# EAGLE design chipheater_01 (EAGLE 9.6.0)
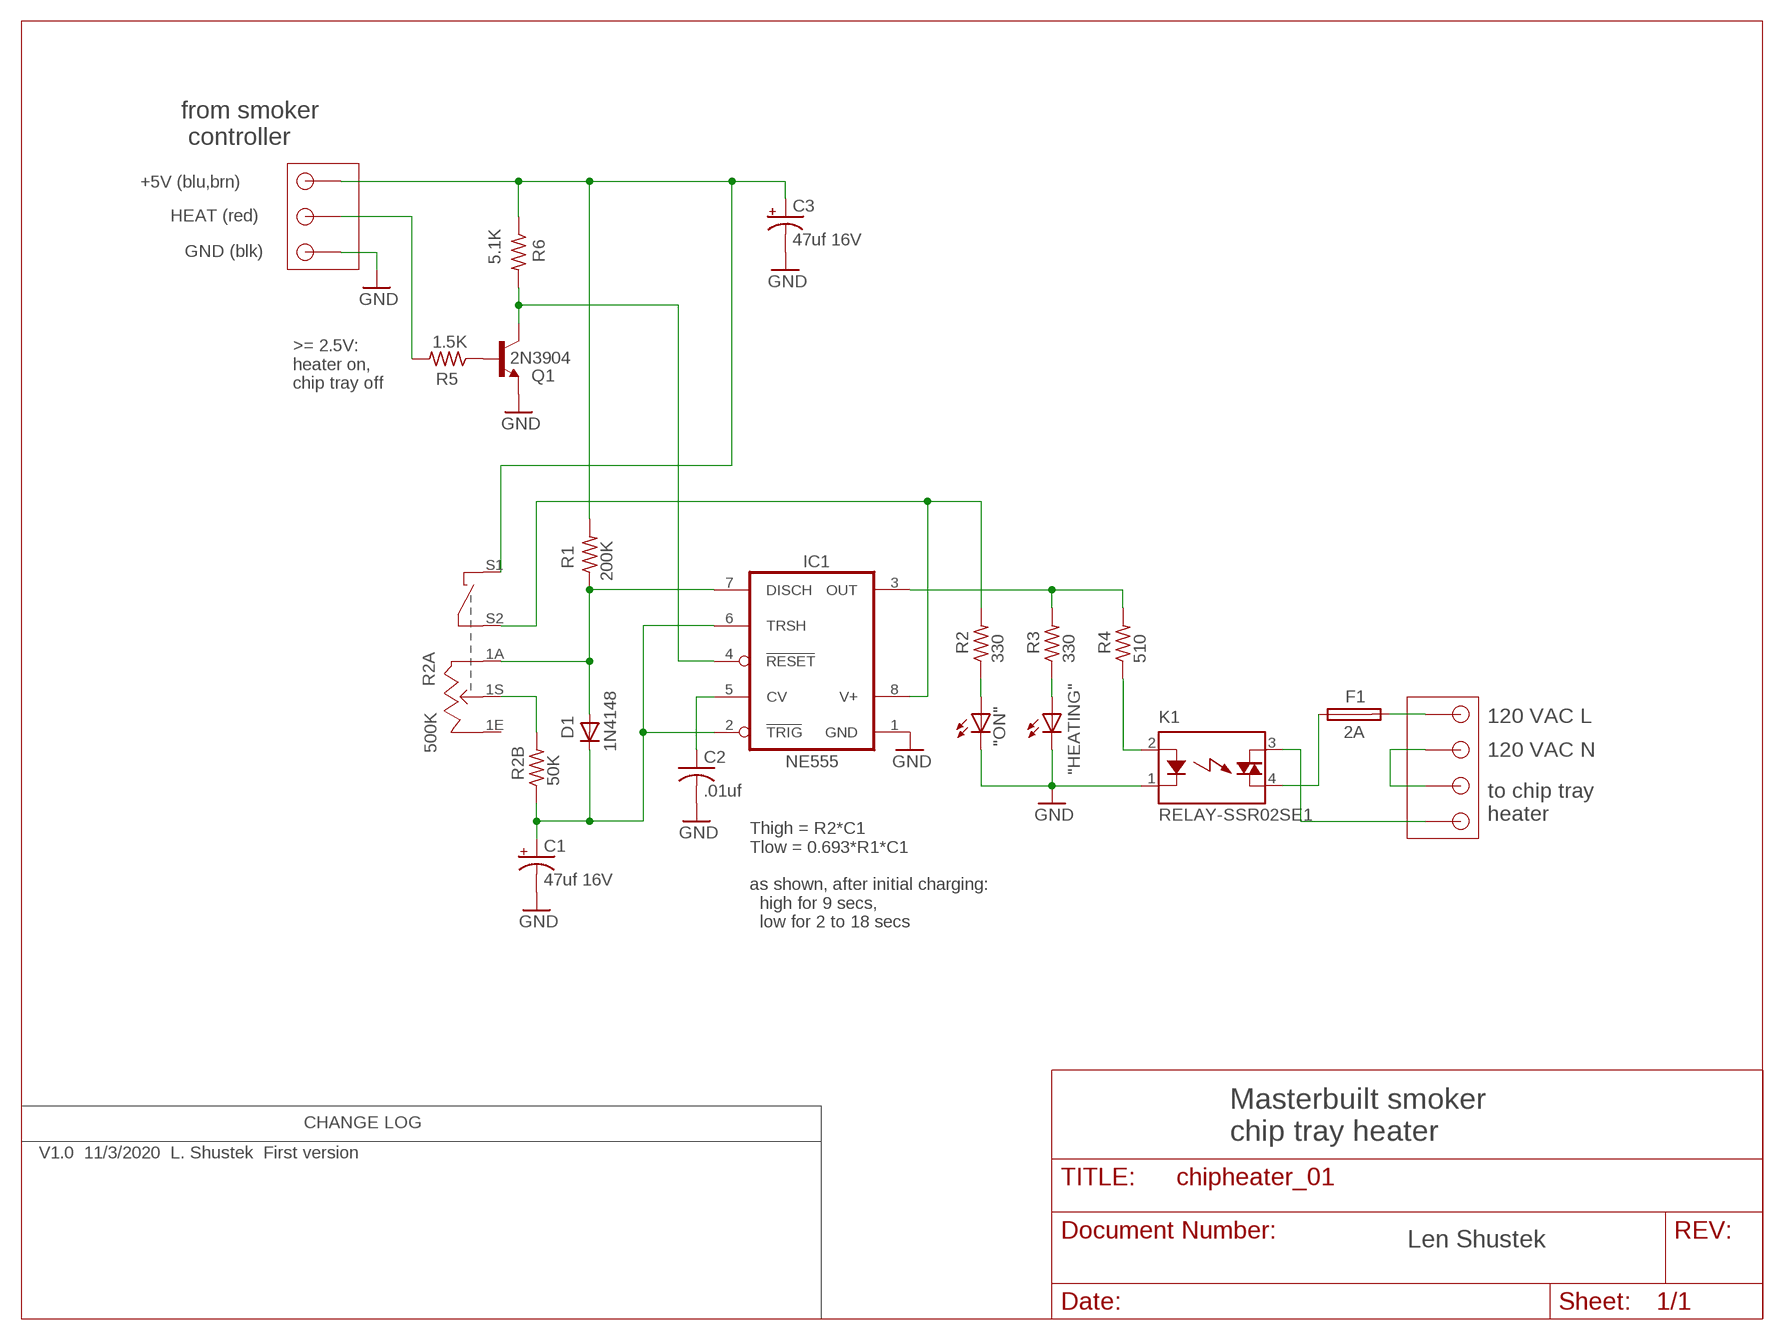
[diagram p0: schematic, sheet 1]

## Parts
"HEATING"  LED5MM  [LED5MM]
"ON"  LED5MM  [LED5MM]
C1  47uf 16V  CPOL-USE2.5-5  [E2,5-5]
C2  .01uf  C-US025-025X050  [C025-025X050]
C3  47uf 16V  CPOL-USE2.5-5  [E2,5-5]
D1  1N4148  DIODEDO-1N4148  [DO-1N4148]
F1  2A  FUSESH22,5A  [SH22,5A]
IC1  NE555  ICM7555  [DIL08]
K1  RELAY-SSR02SE1  [RELAY-SSR]
Q1  2N3904  [TO92]
R1  200K  R-US_0204/7  [0204/7]
R2  330  R-US_0204/7  [0204/7]
R2A  500K  POT_W/SWITCHUXCELL  [POT_W/SWITCH-UXCELL]
R2B  50K  R-US_0204/7  [0204/7]
R3  330  R-US_0204/7  [0204/7]
R4  510  R-US_0204/7  [0204/7]
R5  1.5K  R-US_0204/7  [0204/7]
R6  5.1K  R-US_0204/7  [0204/7]
U$1  CONNECTOR-4PIN  [CONNECTOR-4PIN-5MM_THIN]
U$2  CONNECTOR-3PIN  [CONNECTOR-3PIN-5MM_THIN]

## Nets
-RESET: IC1.4(RESET) Q1.1(C) R6.2
AC-L [AC power]: F1.2 U$1.P$1
AC-N [AC power]: U$1.P$2 U$1.P$3
GND [GND]: "HEATING".K(C) "ON".K(C) C1.- C2.2 C3.- IC1.1(GND) K1.1(K) Q1.3(E) U$2.P$1
HEAT: R5.2 U$2.P$2
HTR [AC power]: K1.3(DS1) U$1.P$4
N$1: "ON".A R2.1
N$2: Q1.2(B) R5.1
N$3 [AC power]: F1.1 K1.4(DS2)
N$4: IC1.8(V+) R2.2 R2A.S2
N$5: K1.2(A) R4.1
N$6: D1.A IC1.7(DISCH) R1.1 R2A.1A
N$7: R2A.1S R2B.2
N$9: C2.1 IC1.5(CV)
N$10: C1.+ D1.C IC1.2(TRIG) IC1.6(TRSH) R2B.1
N$13: IC1.3(OUT) R3.2 R4.2
N$18: "HEATING".A R3.1
VCC [VCC]: C3.+ R1.2 R2A.S1 R6.1 U$2.P$3
Unconnected: R2A.1E

## Notes on the sheet
- from smoker
   controller
- +5V (blu,brn)
- HEAT (red)
- GND (blk)
- >= 2.5V: 
  heater on,
  chip tray off
- 120 VAC L
- 120 VAC N
- to chip tray
  heater
- Thigh = R2*C1
  Tlow = 0.693*R1*C1
  
  as shown, after initial charging:
    high for 9 secs,
    low for 2 to 18 secs
- CHANGE LOG
- Masterbuilt smoker
  chip tray heater
- V1.0  11/3/2020  L. Shustek  First version
- Len Shustek

## Library data of the parts
"HEATING" "ON" = Len:LED: LED OSRAM: - CHIPLED LG R971, LG N971, LY N971, LG Q971, LY Q971, LO R971, LY R971 LH N974, LH R974 LS Q976, LO Q976, LY Q976 LO Q996 - Hyper CHIPLED LW Q18S LB Q993, LB Q99A, LB R99A - SideLED LS A670, LO A670, LY A670, LG A670, LP A670 LB A673, LV A673, LT A673, LW A673 LH A674 LY A675 LS A676, LA A676, LO A676, LY A676, LW A676 LS A679, LY A679, LG A679 - Hyper Micro SIDELED® LS Y876, LA Y876, LO Y876, LY Y876 LT Y87S - SmartLED LW L88C, LW L88S LB L89C, LB L89S, LG L890 LS L89K, LO L89K, LY L89K LS L896, LA L896, LO L896, LY L896 - TOPLED LS T670, LO T670, LY T670, LG T670, LP T670 LSG T670, LSP T670, LSY T670, LOP T670, LYG T670 LG T671, LOG T671, LSG T671 LB T673, LV T673, LT T673, LW T673 LH T674 LS T676, LA T676, LO T676, LY T676, LB T676, LH T676, LSB T676, LW T676 LB T67C, LV T67C, LT T67C, LS T67K, LO T67K, LY T67K, LW E67C LS E67B, LA E67B, LO E67B, LY E67B, LB E67C, LV E67C, LT E67C LW T67C LS T679, LY T679, LG T679 LS T770, LO T770, LY T770, LG T770, LP T770 LB T773, LV T773, LT T773, LW T773 LH T774 LS E675, LA E675, LY E675, LS T675 LS T776, LA T776, LO T776, LY T776, LB T776 LHGB T686 LT T68C, LB T68C - Hyper Mini TOPLED® LB M676 - Mini TOPLED Santana® LG M470 LS M47K, LO M47K, LY M47K Source: http://www.osram.convergy.de/
C1 C3 = resistor:CPOL-US: POLARIZED CAPACITOR, American symbol
C2 = resistor:C-US: CAPACITOR, American symbol
D1 = adafruit:DIODE: Diode SMADIODE - SMA Surface Mount Package 20V 1A Schottky Diode Digikey: 641-1014-6-ND DO-1N4148 - Through Hole Small Current Diode SOD-123 20V 1 A (.5mV Vf) Schottky Diode - Digikey: MBRX120TPMSCT-ND SOD-323 10V 570mA (.38mV Vf, 3ns) Schottky Diode - Digikey: ZLLS410CT-ND SOD-523 30V 30mA Schottky Diode (RB751S-40TE61) - Digikey: RB751S-40TE61CT-ND SOT23-R/W - SOT23 Package (R = Solder Paste/Reflow Ovens, W = Hand-Soldering) BAT54Film 40V 300mA - Digikey: 497-7162-1-ND
F1 = fuse:FUSE: Fuse; OC_FARNELL: unknown; OC_NEWARK: unknown
IC1 = maxim:ICM7555: TIMER; MF: MAXIM; MPN: ICM7555IPA+; OC_FARNELL: 9663762; OC_NEWARK: 68K4387
K1 = Len:RELAY-SSR: SIP Type SSR for Medium Power Control SHARP Source: 168149-da-01-en-Solid_State_Relais_S_202_SE1_SE2.pdf; OC_FARNELL: unknown; OC_NEWARK: unknown
Q1 = transistor:2N3904: NPN TRANSISTOR
R1 R2 R2B R3-R6 = resistor:R-US_: RESISTOR, American symbol
R2A = Len:POT_W/SWITCH: POTENTIOMETER vertical single carbon potentiometer with switch, 16 mm
U$1 = Len:CONNECTOR-4PIN
U$2 = Len:CONNECTOR-3PIN: 3-pin wire-to-board connector

## Net classes
0 default: width 0.635 mm, clearance 0.508 mm
1 GND: width 0.635 mm, clearance 0.508 mm
2 VCC: width 0.635 mm, clearance 0.508 mm
3 AC power: width 2.54 mm, clearance 0.635 mm

## Board
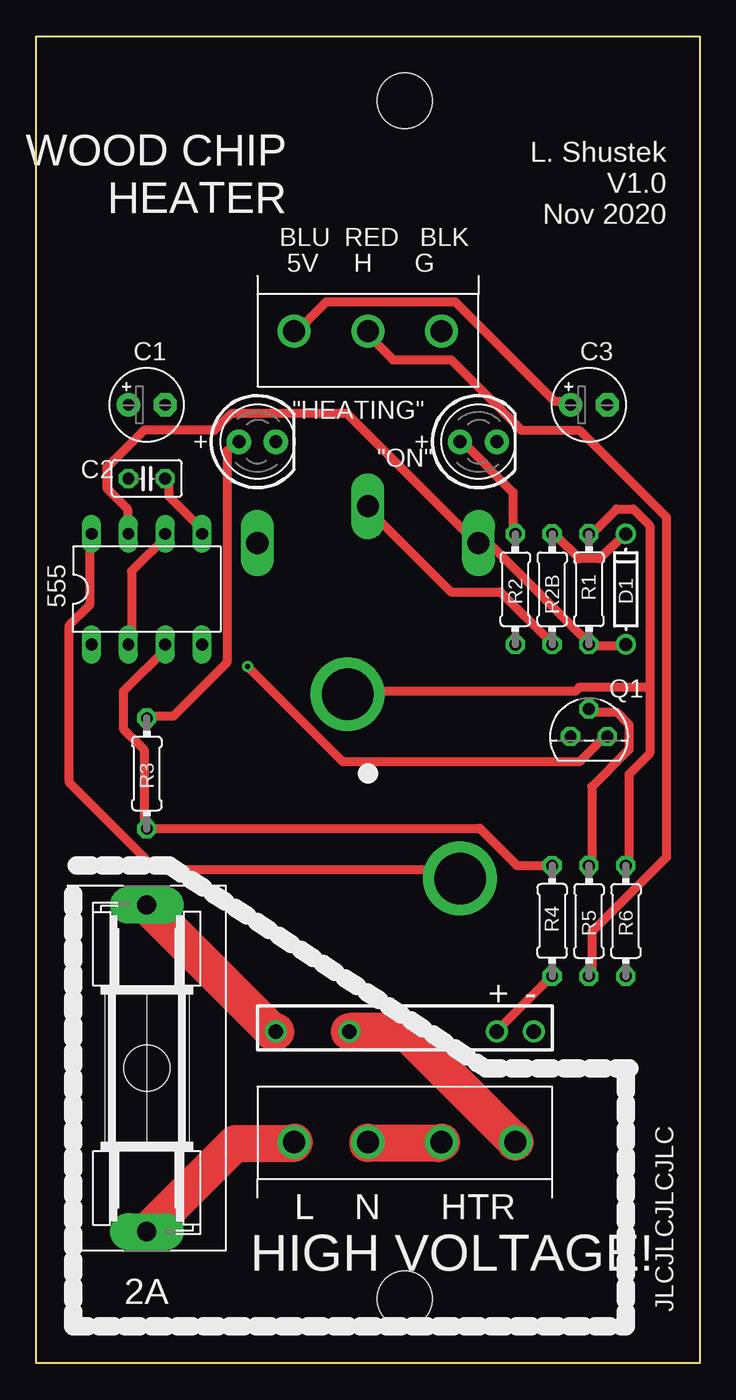
[diagram p1: board, top side]
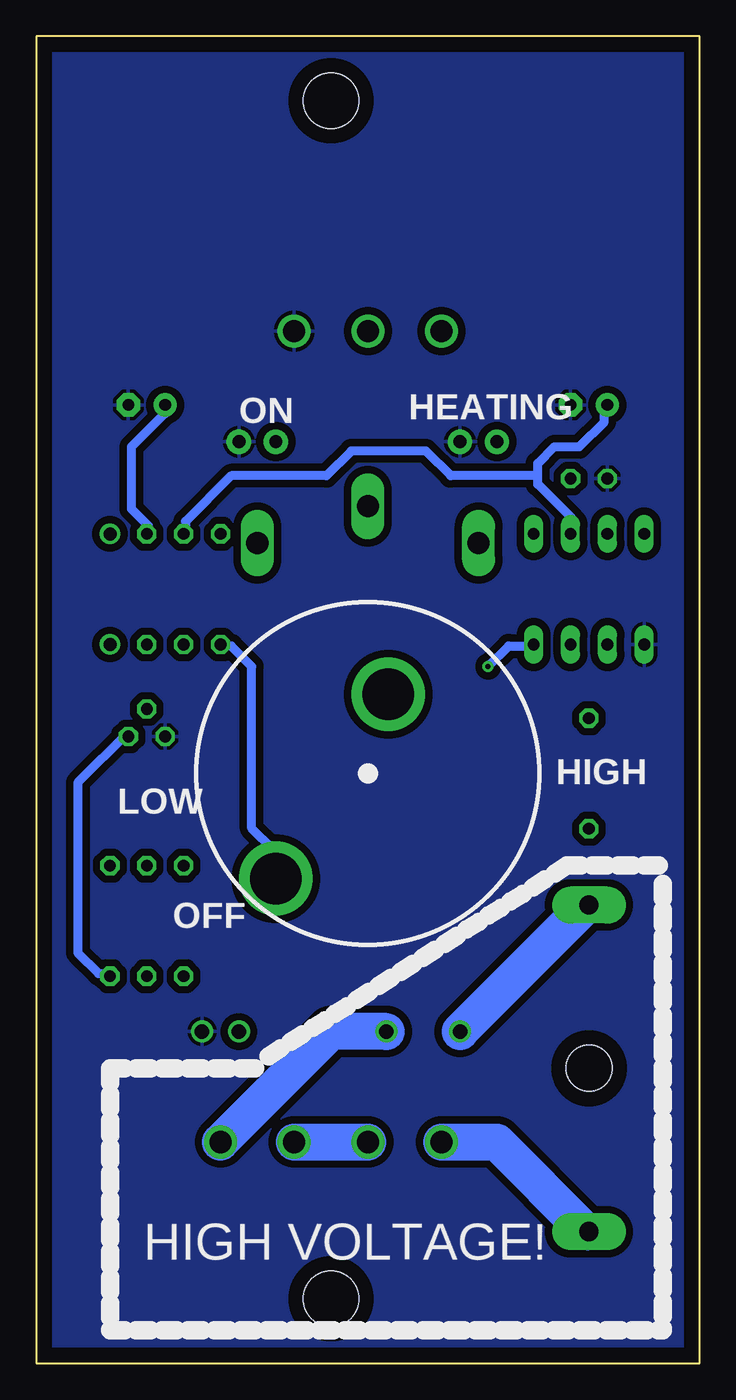
[diagram p2: board, bottom side, seen from below]

Size 45.72 x 91.44 mm. Coordinates in mm from the lower left corner, seen from the top.
Outline: 0,91.44 45.72,91.44 45.72,0 0,0 0,91.44
Copper layers (1*16): Top 0.035mm / dielectric 1.5mm / Bottom 0.035mm
Design rules "default": minimum track width 6mil, minimum drill 0.35mm, track to track 6mil, track to pad 6mil, pad to pad 6mil, via to via 6mil, smd to smd 6mil, copper to edge 40mil, drill to drill 6mil, minimum pad ring 10mil, minimum via ring 8mil, stop-mask expansion 4mil, vias tented up to drill 0mil, thermal gap 10mil
Holes 3.81 mm at 25.4,87 25.4,4.45
Holes 3.17 mm at 7.62,20.32

### Footprints (pad centres in the part's own frame; a part is rotated, then mirrored left to right if it is on the bottom)
LED5MM = drill 0.889 pad 1.676: A -1.27,0; K 1.27,0
E2,5-5 = drill 0.813 pad 1.6: + -1.27,0 | drill 0.813 pad 1.6 octagon: - 1.27,0
C025-025X050 = drill 0.813 octagon: 1 -1.27,0; 2 1.27,0
DO-1N4148 = drill 0.9: A -3.81,0; C 3.81,0
SH22,5A = drill 1.321 pad 2.54 long: 1 -11.252,0; 2 11.252,0
DIL08 = drill 0.813 long: 1 -3.81,-3.81; 2 -1.27,-3.81; 3 1.27,-3.81; 4 3.81,-3.81; 5 3.81,3.81; 6 1.27,3.81; 7 -1.27,3.81; 8 -3.81,3.81
RELAY-SSR = drill 1: 1 8.89,0; 2 6.35,0; 3 -3.81,0; 4 -8.89,0
TO92 = drill 0.813 octagon: 1 1.27,0; 2 0,1.905; 3 -1.27,0
0204/7 = drill 0.813 octagon: 1 -3.81,0; 2 3.81,0
POT_W/SWITCH-UXCELL = drill 1.524 long: 1A -7.62,15.875; 1E 7.62,15.875; 1S 0,18.415 | drill 3.556 pad 5.08: S1 1.397,5.461; S2 -6.35,-7.239
CONNECTOR-4PIN-5MM_THIN = drill 1.524: P$1 0,2.54; P$2 0,-2.54; P$3 0,-7.62; P$4 0,-12.7
CONNECTOR-3PIN-5MM_THIN = drill 1.524: P$1 0,5.08; P$2 0,0; P$3 0,-5.08

### Placement (x,y rotation side)
"HEATING"  15.24,63.5 0 top
"ON"  30.48,63.5 0 top
C1  7.62,66.04 0 top
C2  7.62,60.96 180 top
C3  38.1,66.04 0 top
D1  40.64,53.34 90 top
F1  7.62,20.32 270 top
IC1  7.62,53.34 0 top
K1  25.4,22.86 0 top
Q1  38.1,43.18 0 top
R1  38.1,53.34 90 top
R2  33.02,53.34 270 top
R2A  22.86,40.64 0 bottom
R2B  35.56,53.34 270 top
R3  7.62,40.64 270 top
R4  35.56,30.48 90 top
R5  38.1,30.48 270 top
R6  40.64,30.48 270 top
U$1  20.32,15.24 90 top
U$2  22.86,71.12 270 top

### Tracks (layer width: path | path; a pad name or v marks a point on that pad's centre or on a via)
-RESET  (via drill 0.35)
  Top 0.635: v14.57,48.01 21.14,41.43 37.43,41.43 39.15,43.15 Q1.1
  Bottom 0.635: v14.57,48.01 13.14,49.44 11.43,49.44 IC1.4 | R6.2 40.86,26.86 41.43,26.86 42.86,28.29 42.86,40.01 39.43,43.43 Q1.1
AC-L
  Top 2.54: U$1.P$1 17.72,15.14 13.72,15.14 7.71,9.14 F1.2
  Bottom 2.54: U$1.P$1 13.97,15.24 7.8,9.07 F1.2
AC-N
  Top 2.54: U$1.P$2 22.86,15.14 27.72,15.14 U$1.P$3
  Bottom 2.54: U$1.P$3 U$1.P$2
GND
  pour Bottom: -2.54,91.44 48.26,91.44 48.26,-2.54 -2.54,-2.54
HEAT
  Top 0.635: R5.2 38.29,26.86 38.29,29.72 43.43,34.86 43.43,58.29 37.43,64.29 33.43,64.29 28.57,69.15 24.57,69.15 22.86,70.87 U$2.P$2
HTR
  Top 2.54: K1.3 25.43,22.86 32.86,15.43 U$1.P$4
  Bottom 2.54: K1.3 25.4,22.86 U$1.P$4
N$1
  Top 0.635: R2.1 32.86,57.15 32.86,60.01 29.43,63.44 "ON".A
N$2
  Top 0.635: R5.1 38.29,34.29 38.29,39.72 40.86,42.29 40.86,44.01 40.01,44.86 38.29,44.86 Q1.2
N$3
  Top 2.54: K1.4 16.29,22.86 7.71,31.43 F1.1
  Bottom 2.54: K1.4 7.8,31.57 F1.1
N$4
  Top 0.635: IC1.8 3.71,57.15 3.71,52.29 2.29,50.86 2.29,40.01 8.29,34 28.57,34 29.15,33.43 R2A.S2
  Bottom 0.635: R2.2 32.86,49.44 32.29,49.44 30.86,48.01 30.86,36.86 29.43,35.43 29.43,33.43 R2A.S2
N$5
  Top 0.635: R4.1 35.43,26.57 31.72,22.86 K1.2
N$6
  Top 0.635: D1.A 40.58,49.44 38.29,49.44 R1.1 38.01,49.72 31.43,56.29 30.57,56.29 R2A.1A 30.29,56.58 21.43,65.44 13.43,65.44 12.29,64.29 7.43,64.29 4.86,61.72 4.86,60.29 6.29,58.86 6.29,57.15 IC1.7
N$7
  Top 0.635: R2B.2 35.43,49.72 32,53.15 28.57,53.15 22.86,58.86 R2A.1S
N$9
  Top 0.635: IC1.5 11.43,57.44 9.14,59.72 9.14,60.87 C2.1
N$10
  Top 0.635: R2B.1 35.72,57.15 37.43,55.44 38.86,55.44 40.58,57.15 D1.C | IC1.2 6.57,49.72 6.57,54.58 9.14,57.15 IC1.6
  Bottom 0.635: 11.14,61.15 11.14,60.58 8.86,58.29 8.86,57.15 IC1.6 | 11.14,61.15 11.14,62.01 10,63.15 8.29,63.15 6.57,64.86 6.57,66.01 C1.+ | 11.14,61.15 17.14,61.15 18.86,62.87 24,62.87 25.72,61.15 32.29,61.15 35.43,58.01 35.43,57.15 R2B.1
N$13
  Top 0.635: IC1.3 9.14,49.44 6,46.29 6,43.72 7.43,42.29 7.43,36.86 R3.2 7.71,36.86 30.57,36.86 33.15,34.29 R4.2
N$18
  Top 0.635: R3.1 7.71,44.58 9.43,44.58 13.14,48.29 13.14,62.87 13.72,63.44 "HEATING".A
VCC
  Top 0.635: C3.+ 36.58,66.29 35.72,66.29 28.86,73.15 20,73.15 18,71.15 U$2.P$3 | 42.29,46.58 42.29,57.72 41.15,58.86 40.01,58.86 38.29,57.15 R1.2 | 42.29,46.58 42.29,42.01 40.86,40.58 40.86,34.29 R6.1 | 42.29,46.58 37.43,46.58 37.15,46.29 21.72,46.29 R2A.S1
  Bottom 0.635: C3.+ 36.86,66.01 36.86,65.44 39.15,63.15 39.15,58.86 38.01,57.72 38.01,57.15 R1.2

### Text on the board
tPlace: WOOD CHIP / HEATER | L. Shustek / V1.0 / Nov 2020 | BLU RED BLK | 5V H G | 555 | L N HTR | 2A | HIGH VOLTAGE! | JLCJLCJLCJLC
bPlace: HEATING | ON | HIGH | LOW | OFF | HIGH VOLTAGE!